# EAGLE design Eagle (EAGLE 9.2.2)
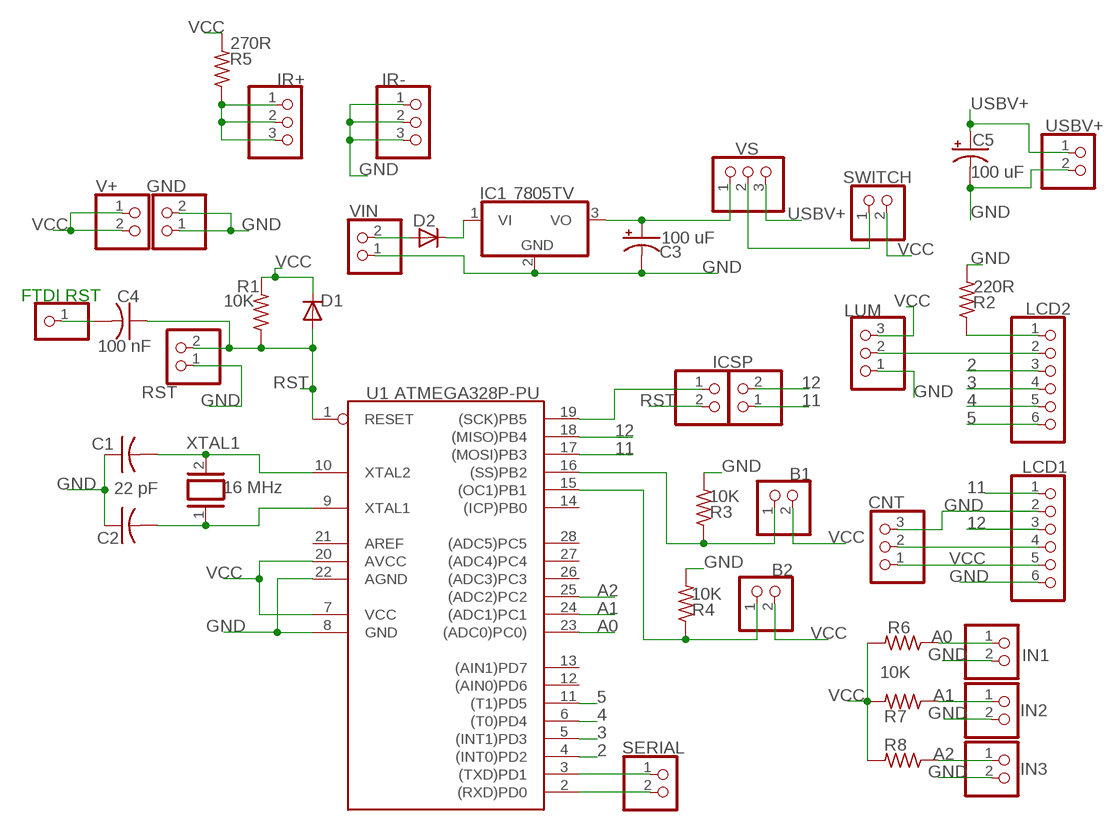
[diagram p0: schematic, sheet 1]

## Parts
B1  PINHD-1X2  [1X02]
B2  PINHD-1X2  [1X02]
C1  22 pF  C-US025-025X050  [C025-025X050]
C2  22 pF  C-US025-025X050  [C025-025X050]
C3  100 uF  CPOL-USE5-6  [E5-6]
C4  100 nF  C-US102-043X133  [C102-043X133]
C5  100 uF  CPOL-USB45181A  [B45181A]
CNT  PINHD-1X3  [1X03]
D1  1N4148DO35-7  [DO35-7]
D2  1N4148DO35-7  [DO35-7]
FTDI_RST  PINHD-1X1  [1X01]
GND  PINHD-1X2  [1X02]
IC1  7805TV  [TO220V]
ICSP  PINHD-1X2  [1X02]
ICSP2  PINHD-1X2  [1X02]
IN1  PINHD-1X2  [1X02]
IN2  PINHD-1X2  [1X02]
IN3  PINHD-1X2  [1X02]
IR+  PINHD-1X3  [1X03]
IR-  PINHD-1X3  [1X03]
LCD1  PINHD-1X6  [1X06]
LCD2  PINHD-1X6  [1X06]
LUM  PINHD-1X3  [1X03]
R1  10K  R-US_0204/5  [0204/5]
R2  220R  R-US_0204/5  [0204/5]
R3  10K  R-US_0204/5  [0204/5]
R4  10K  R-US_0204/5  [0204/5]
R5  270R  R-US_0207/10  [0207/10]
R6  10K  R-US_0204/5  [0204/5]
R7  10K  R-US_0204/5  [0204/5]
R8  10K  R-US_0204/5  [0204/5]
RST  PINHD-1X2  [1X02]
SERIAL  PINHD-1X2  [1X02]
SWITCH  PINHD-1X2  [1X02]
U1  ATMEGA328P-PU  [DIL28-3]
USBV+  PINHD-1X2  [1X02]
V+  PINHD-1X2  [1X02]
VIN  PINHD-1X2  [1X02]
VS  PINHD-1X3  [1X03]
XTAL1  16 MHz  XTAL/S  [QS]

## Nets
2: LCD2.3 U1.4((INT0)PD2)
3: LCD2.4 U1.5((INT1)PD3)
4: LCD2.5 U1.6((T0)PD4)
5: LCD2.6 U1.11((T1)PD5)
10: B1.1 R3.1 U1.16((SS)PB2)
11: ICSP2.1 LCD1.1 U1.17((MOSI)PB3)
12: ICSP2.2 LCD1.3 U1.18((MISO)PB4)
A0: IN1.1 R6.1 U1.23((ADC0)PC0))
A1: IN2.1 R7.1 U1.24((ADC1)PC1)
A2: IN3.1 R8.1 U1.25((ADC2)PC2)
GND: C1.1 C2.1 C3.- C5.- CNT.3 GND.1 GND.2 IC1.2(GND) IN1.2 IN2.2 IN3.2 IR-.1 IR-.2 IR-.3 LCD1.2 LCD1.6 LUM.1 R2.2 R3.2 R4.2 RST.1 U1.8(GND) U1.22(AGND) USBV+.2 VIN.1
N$1: C3.+ IC1.3(VO) VS.1
N$2: C1.2 U1.10(XTAL2) XTAL1.2
N$3: C2.2 U1.9(XTAL1) XTAL1.1
N$4: D2.A VIN.2
N$5: D2.C IC1.1(VI)
N$6: C4.2 FTDI_RST.1
N$7: ICSP.1 U1.19((SCK)PB5)
N$9: B2.1 R4.1 U1.15((OC1)PB1)
N$10: SWITCH.1 VS.2
N$14: LCD2.1 R2.1
N$15: CNT.2 LCD1.4
N$16: LCD2.2 LUM.2
N$21: IR+.1 IR+.2 IR+.3 R5.1
RST: C4.1 D1.A ICSP.2 R1.1 RST.2 U1.1(RESET)
RX: SERIAL.2 U1.2((RXD)PD0)
TX: SERIAL.1 U1.3((TXD)PD1)
USBV+: C5.+ USBV+.1 VS.3
VCC: B1.2 B2.2 CNT.1 D1.C LCD1.5 LUM.3 R1.2 R5.2 R6.2 R7.2 R8.2 SWITCH.2 U1.7(VCC) U1.20(AVCC) V+.1 V+.2
Unconnected: U1.12((AIN0)PD6) U1.13((AIN1)PD7) U1.14((ICP)PB0) U1.21(AREF) U1.26((ADC3)PC3) U1.27((ADC4)PC4) U1.28((ADC5)PC5)

## Notes on the sheet
- FTDI RST

## Library data of the parts
B1 B2 GND ICSP ICSP2 IN1-IN3 RST SERIAL SWITCH USBV+ V+ VIN = pinhead:PINHD-1X2: PIN HEADER
C1 C2 = Adafruit:C-US: CAPACITOR, American symbol
C3 = rcl:CPOL-US: POLARIZED CAPACITOR, American symbol
C4 = rcl:C-US: CAPACITOR, American symbol
C5 = Adafruit:CPOL-US: POLARIZED CAPACITOR, American symbol
CNT IR+ IR- LUM VS = pinhead:PINHD-1X3: PIN HEADER
D1 D2 = diode:1N4148: DIODE high speed (Philips)
FTDI_RST = Adafruit:PINHD-1X1: Pin header 1x1 for 0.1" spacing With round pins
IC1 = linear:78*: Positive VOLTAGE REGULATOR Source: http://cache.national.com/ds/LM/LM78L05.pdf http://www.fairchildsemi.com/ds/LM/LM7805.pdf
LCD1 LCD2 = pinhead:PINHD-1X6: PIN HEADER
R1-R8 = Adafruit:R-US_: RESISTOR, American symbol
U1 = SmartPrj:ATMEGA328P-: MICROCONTROLLER 4 Kbytes FLASH 128 bytes SRAM 256 bytes EEPROM UART 6-channel 10 bit ADC
XTAL1 = special:XTAL/S: CRYSTAL

## Net classes
0 default: width 0.254 mm, clearance 0.254 mm
1 power: width 0.61 mm, drill 0.61 mm, clearance 0.254 mm
2 gnd: width 0.305 mm, drill 0.559 mm, clearance 0.254 mm
3 usbvcc: width 0.508 mm, drill 0.61 mm, clearance 0.254 mm
4 aref: width 0.406 mm, drill 0.61 mm, clearance 0.254 mm

## Board
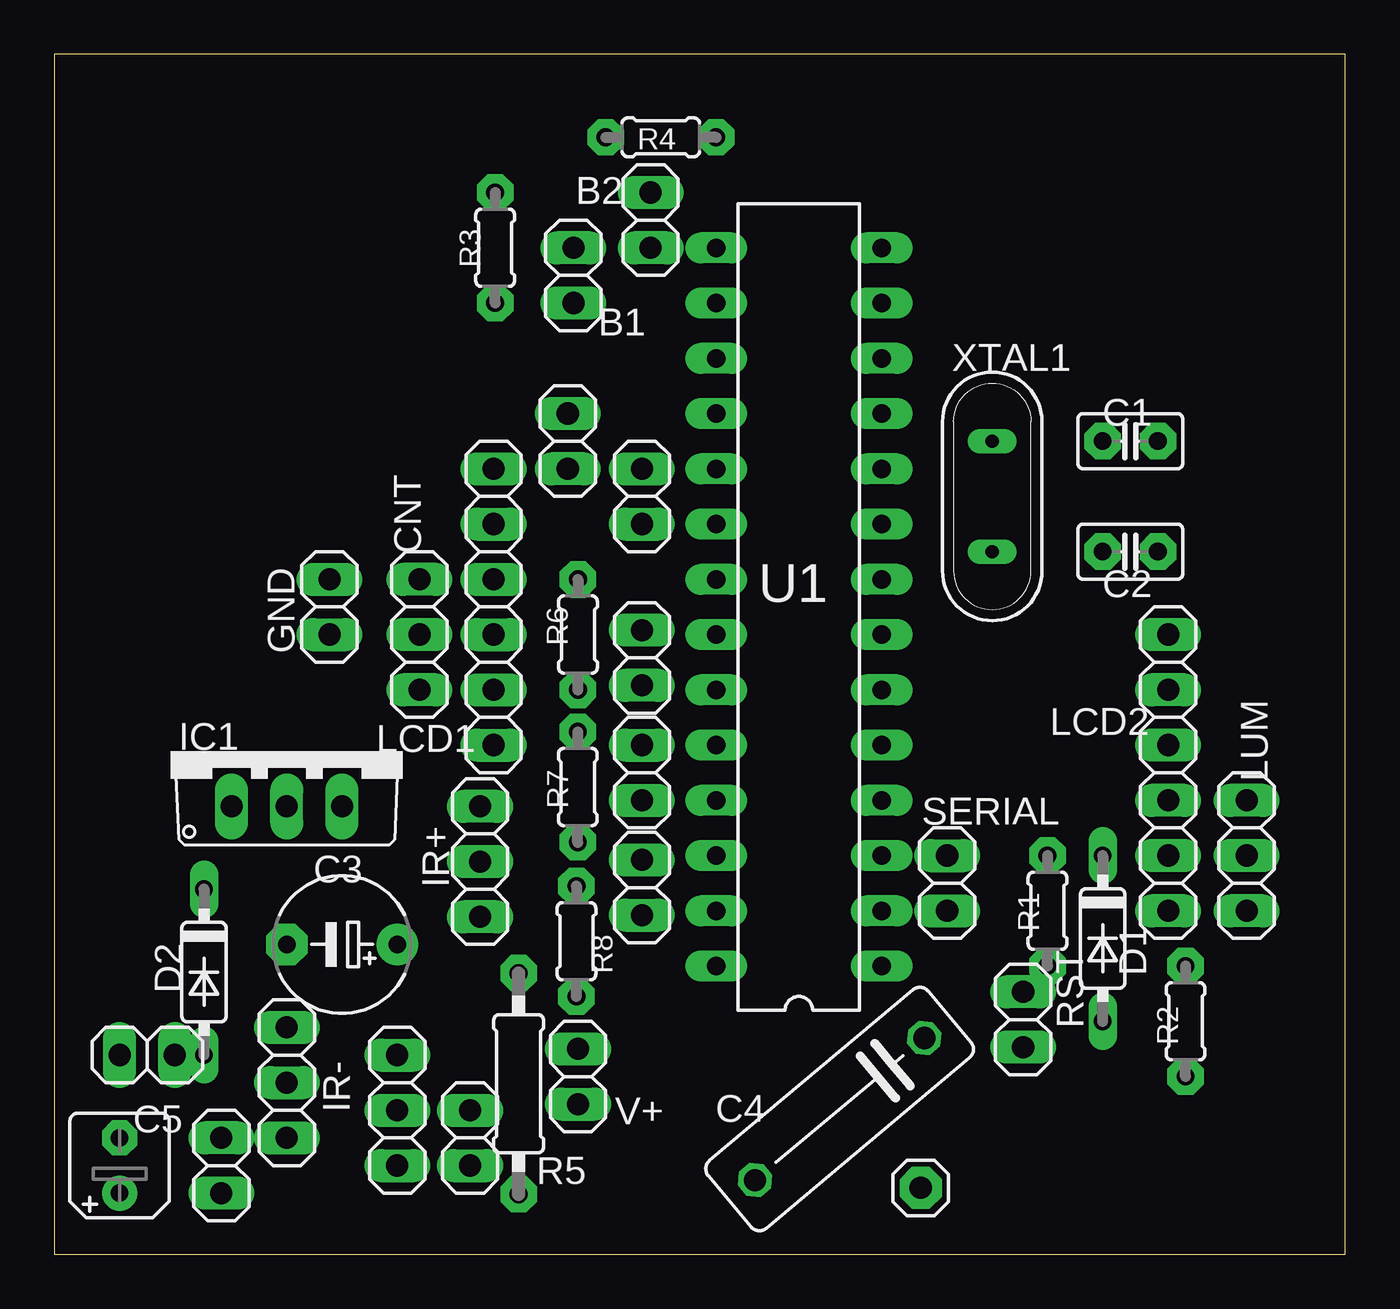
[diagram p1: board, top side]
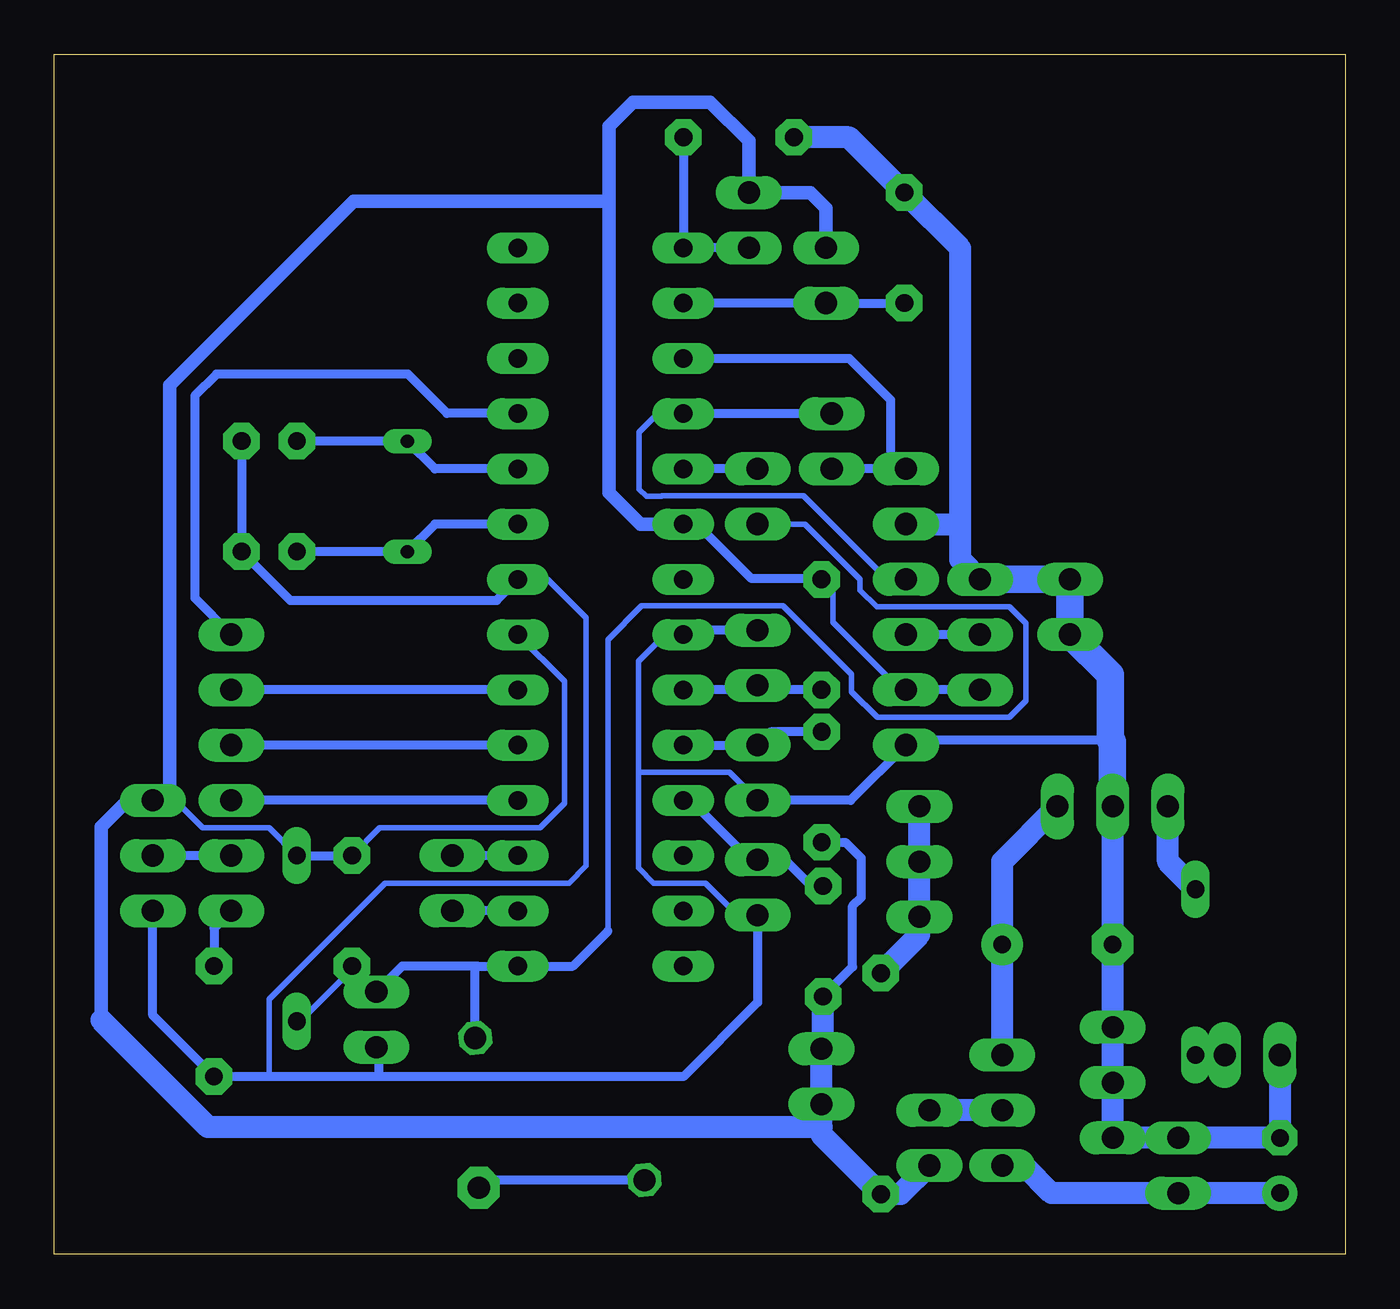
[diagram p2: board, bottom side, seen from below]

Size 59.36 x 55.17 mm. Coordinates in mm from the lower left corner, seen from the top.
Outline: 0,0 59.36,0 59.36,55.17 0,55.17 0,0
Copper layers (1*16): Top 0.035mm / dielectric 1.5mm / Bottom 0.035mm
Design rules "default": minimum track width 10mil, minimum drill 24mil, track to track 8mil, track to pad 8mil, pad to pad 8mil, via to via 8mil, smd to smd 8mil, copper to edge 40mil, drill to drill 8mil, minimum pad ring 10mil, minimum via ring 8mil, stop-mask expansion 4mil, vias tented up to drill 0mil, thermal gap 10mil

### Footprints (pad centres in the part's own frame; a part is rotated, then mirrored left to right if it is on the bottom)
1X02 = drill 1.016 long: 1 -1.27,0; 2 1.27,0
C025-025X050 = drill 0.813 pad 1.676 octagon: 1 -1.27,0; 2 1.27,0
E5-6 = drill 0.813 pad 1.905: + -2.54,0 | drill 0.813 pad 1.905 octagon: - 2.54,0
C102-043X133 = drill 1.016 octagon: 1 -5.08,0; 2 5.08,0
B45181A = drill 0.813 pad 1.6: + -1.27,0 | drill 0.813 pad 1.6 octagon: - 1.27,0
1X03 = drill 1.016 long: 1 -2.54,0; 2 0,0; 3 2.54,0
DO35-7 = drill 0.813 long: A 3.81,0; C -3.81,0
1X01 = drill 1.016 pad 1.93 octagon: 1 0,0
TO220V = drill 1.016 long: 1 -2.54,-2.54; 2 0,-2.54; 3 2.54,-2.54
1X06 = drill 1.016 long: 1 -6.35,0; 2 -3.81,0; 3 -1.27,0; 4 1.27,0; 5 3.81,0; 6 6.35,0
0204/5 = drill 0.813 pad 1.676 octagon: 1 -2.54,0; 2 2.54,0
0207/10 = drill 0.813 pad 1.676 octagon: 1 -5.08,0; 2 5.08,0
DIL28-3 = drill 0.85 pad 1.422 long: 1 -16.51,-3.81; 2 -13.97,-3.81; 3 -11.43,-3.81; 4 -8.89,-3.81; 5 -6.35,-3.81; 6 -3.81,-3.81; 7 -1.27,-3.81; 8 1.27,-3.81; 9 3.81,-3.81; 10 6.35,-3.81; 11 8.89,-3.81; 12 11.43,-3.81; 13 13.97,-3.81; 14 16.51,-3.81; 15 16.51,3.81; 16 13.97,3.81; 17 11.43,3.81; 18 8.89,3.81; 19 6.35,3.81; 20 3.81,3.81; 21 1.27,3.81; 22 -1.27,3.81; 23 -3.81,3.81; 24 -6.35,3.81; 25 -8.89,3.81; 26 -11.43,3.81; 27 -13.97,3.81; 28 -16.51,3.81
QS = drill 0.61 long: 1 -2.54,0; 2 2.54,0

### Placement (x,y rotation side)
B1  23.87,45.01 90 top
B2  27.42,47.55 90 top
C1  49.48,37.39 180 top
C2  49.48,32.31 180 top
C3  13.23,14.25 180 top
C4  36.11,6.69 220 top
C5  3,4.09 90 top
CNT  16.79,28.5 90 top
D1  48.21,14.53 270 top
D2  6.88,12.98 270 top
FTDI_RST  39.84,3.06 0 top
GND  12.65,29.77 270 top
IC1  10.69,23.14 0 top
ICSP  27.02,34.85 270 top
ICSP2  23.61,37.39 90 top
IN1  27.02,27.43 90 top
IN2  27.02,22.15 270 top
IN3  27.02,16.87 270 top
IR+  19.58,18.06 90 top
IR-  10.69,7.9 270 top
LCD1  20.2,29.77 270 top
LCD2  51.22,22.15 90 top
LUM  54.83,18.34 90 top
R1  45.67,15.8 90 top
R2  52.02,10.72 270 top
R3  20.27,46.28 90 top
R4  27.89,51.36 180 top
R5  21.35,7.85 270 top
R6  24.08,28.5 90 top
R7  24.07,21.49 270 top
R8  24.01,14.4 270 top
RST  44.55,10.8 90 top
SERIAL  41.06,17.07 270 top
SWITCH  19.12,5.36 270 top
U1  34.24,29.77 90 top
USBV+  7.68,4.09 90 top
V+  24.08,8.18 270 top
VIN  4.27,9.17 0 top
VS  15.77,6.63 270 top
XTAL1  43.13,34.85 90 top

### Tracks (layer width: path | path; a pad name or v marks a point on that pad's centre or on a via)
2
  Bottom 0.406: U1.4 LCD2.3
3
  Bottom 0.406: U1.5 LCD2.4
4
  Bottom 0.406: U1.6 LCD2.5
5
  Bottom 0.406: U1.11 41.3,38.67 43.1,40.47 51.9,40.47 52.9,39.47 52.9,30.18 LCD2.6
10
  Bottom 0.406: U1.16 B1.1 R3.1
11
  Bottom 0.406: LCD1.1 20.9,36.12 | 20.9,36.12 ICSP2.1 | U1.17 22.81,41.2 20.9,39.29 20.9,36.12
12
  Bottom 0.254: LCD1.3 21.07,31.04 24.9,34.87 31.43,34.87 31.45,34.85 32.13,34.85 32.46,35.18 32.46,37.81 31.6,38.67 U1.18
  Bottom 0.406: ICSP2.2 U1.18
A0
  Bottom 0.406: R6.1 26.7,25.96 | 26.7,25.96 U1.23 | IN1.1 26.9,26.16 26.7,25.96
A1
  Bottom 0.406: R7.1 26.41,24.03 IN2.1 U1.24
A2
  Bottom 0.406: U1.25 30.11,20.88 27.37,18.14 IN3.1 25.77,18.14 24.57,16.94 R8.1
GND
  Bottom 0.254: 49.48,8.18 49.48,11.74 44.15,17.07 35.7,17.07 34.9,17.87 34.9,29.27 36.67,31.04 U1.8 | U1.22 31.27,28.5 32.5,27.27 32.5,22.17 | IN2.2 28.31,22.17 32.5,22.17 | IN3.2 27.94,15.6 29.41,17.07 31.8,17.07 32.5,17.77 32.5,22.17
  Bottom 0.406: LUM.1 54.83,10.99 R2.2 49.48,8.18 44.45,8.18 | C1.1 C2.1 48.51,30.07 39.02,30.07 U1.8 | IC1.2 | IN2.2 22.74,20.88 LCD1.6 19.95,23.67 10.8,23.67 10.7,23.67 | IN3.2 27.02,11.59 30.43,8.18 44.45,8.18 | IN1.2 30.23,28.7 U1.22 | RST.1 44.45,9.43 44.45,8.18
  Bottom 1.016: VIN.1 C5.- USBV+.2 IR-.3 IR-.2 IR-.1 C3.- IC1.2 | CNT.3 17.7,31.95 17.7,33.57 | 17.7,33.57 17.7,46.25 R3.2 22.81,51.36 R4.2 | LCD1.2 17.7,33.57
  Bottom 1.27: IC1.2 10.7,23.57 10.8,23.67 10.8,26.65 GND.2 GND.1 CNT.3
N$1
  Bottom 1.016: VS.1 C3.+ 15.77,18.06 IC1.3
N$2
  Bottom 0.406: U1.10 41.86,36.12 XTAL1.2 C1.2
N$3
  Bottom 0.406: U1.9 41.86,33.58 XTAL1.1 C2.2
N$4
  Bottom 1.016: D2.A VIN.2
N$5
  Bottom 1.016: D2.C 8.15,18.06 IC1.1
N$6
  Bottom 0.406: C4.2 39.48,3.42 FTDI_RST.1
N$7
  Bottom 0.406: ICSP.1 U1.19
N$9
  Bottom 0.406: B2.1 U1.15 R4.1
N$10
  Bottom 1.016: VS.2 SWITCH.1
N$14
  Bottom 0.406: LCD2.1 52.02,15 R2.1
N$15
  Bottom 0.406: CNT.2 LCD1.4
N$16
  Bottom 0.406: LCD2.2 LUM.2
N$21
  Bottom 1.016: R5.1 19.58,14.7 IR+.1 IR+.2 IR+.3
RST
  Bottom 0.254: ICSP.2 24.84,33.58 22.3,31.04 22.3,30.53 21.54,29.77 15.44,29.77 14.68,29.01 14.68,25.45 15.44,24.69 21.52,24.69 22.7,25.87 22.7,26.67 25.85,29.82 32.35,29.82 33.9,28.27 33.9,14.87 | D1.A 48,10.77 45.75,13.02 R1.1
  Bottom 0.406: 39.9,13.26 43.36,13.26 RST.2 45.67,13.19 | R1.1 45.67,13.19 | 45.67,13.19 45.74,13.19 | C4.1 40,13.16 39.9,13.26 | 39.9,13.26 U1.1 35.51,13.26 33.9,14.87
RX
  Bottom 0.406: U1.2 SERIAL.2
TX
  Bottom 0.406: U1.3 SERIAL.1
USBV+
  Bottom 1.016: C5.+ USBV+.1 13.5,2.82 14.75,4.07 15.75,4.07 VS.3
VCC
  Bottom 0.254: 53.8,20.88 52.53,19.61 49.48,19.61 D1.C | 55.07,20.88 LUM.3 | U1.7 35.9,26.35 35.9,20.74 37.03,19.61 44.4,19.61 R1.2 | LCD1.5 20.44,25.96 23.55,29.07 23.55,30.51 R6.2
  Bottom 0.406: D1.C R1.2 | CNT.1 LCD1.5 | R7.2 22.98,18.95 22.25,18.22 22.25,16.42 22.65,16.02 22.65,13.22 R8.2 24.08,11.79 | R6.2 24.11,31.07 27.3,31.07 29.81,33.58 U1.20 | LUM.3
  Bottom 0.61: 57.2,10.77 57.2,19.67 55.99,20.88 LUM.3 54.3,20.88 | 54.3,20.88 53.8,20.88 | 54.3,20.88 54.05,21.13 54.05,39.97 45.6,48.42 34.05,48.42 33.85,48.62 | 33.85,48.62 33.85,35.02 32.41,33.58 U1.20 | 33.85,48.62 33.85,51.87 32.75,52.97 29.2,52.97 27.42,51.19 B2.2 24.6,48.82 23.87,48.09 B1.2
  Bottom 1.016: SWITCH.2 20.44,2.77 R5.2 24.08,5.5 24.08,5.87 | 24.08,5.87 V+.2 V+.1 24.01,9.52 R8.2 | 57.2,10.77 52.3,5.87 24.08,5.87

### Text on the board
Drawings: A | K | EXT | FTDI RST | USB
Text: JustAPendulum / marcocipriani01 / CC BY-NC-SA